# Altium schematic sheet CH341A.SchDoc
size A4
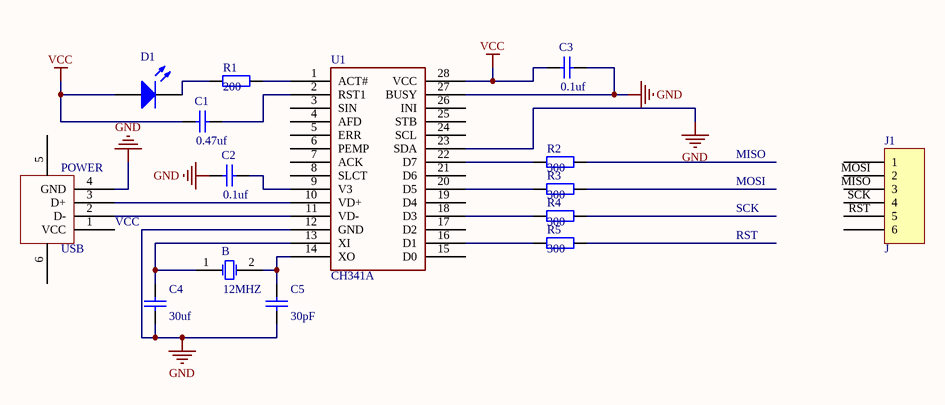
[diagram p0: CH341A.SchDoc]

## Parts
B  12MHZ  [R38]
C1  value 0.47uf  [RAD-0.3]  (hidden comment: Cap)
C2  value 0.1uf  [RAD-0.3]  (hidden comment: Cap)
C3  value 0.1uf  [RAD-0.3]  (hidden comment: Cap)
C4  value 30uf  [RAD-0.3]  (hidden comment: Cap)
C5  value 30pF  [RAD-0.3]  (hidden comment: Cap)
D1  LED0  [LED-0]  (value not drawn)
J1  J
R1  value 200  [AXIAL-0.4]  (hidden comment: Res2)
R2  value 300  [AXIAL-0.4]  (hidden comment: Res2)
R3  value 300  [AXIAL-0.4]  (hidden comment: Res2)
R4  value 300  [AXIAL-0.4]  (hidden comment: Res2)
R5  value 300  [AXIAL-0.4]  (hidden comment: Res2)
U1  CH341A
USB  POWER

## Nets
GND: C2.1 C3.2 C4.1 C5.1 U1.12(GND) U1.23(SDA) U1.27(BUSY) USB.4(GND)
VCC: C1.1 C3.1 D1.1(A) U1.28(VCC)
NetB_1: B.1(OSC1) C4.2 U1.13(XI)
NetB_2: B.2(OSC2) C5.2 U1.14(XO)
NetC1_2: C1.2 U1.2(RST1)
NetC2_2: C2.2 U1.9(V3)
NetD1_2: D1.2(K) R1.1
NetR1_2: R1.2 U1.1(ACT#)
NetR2_1: R2.1 U1.22(D7)
NetR3_1: R3.1 U1.20(D5)
NetR4_1: R4.1 U1.18(D3)
NetR5_1: R5.1 U1.16(D1)
NetU1_10: U1.10(VD+) USB.3(D+)
NetU1_11: U1.11(VD-) USB.2(D-)

Not connected (* = marked no-connect by the designer): J1 ?1(1) ?2(6) MISO(3) MOSI(2) RST(5) SCK(4); R2 2; R3 2; R4 2; R5 2; U1 3(SIN) 4(AFD) 5(ERR) 6(PEMP) 7(ACK) 8(SLCT) 15(D0) 17(D2) 19(D4) 21(D6) 24(SCL) 25(STB) 26(INI); USB 1(VCC) 5 6

## Notes on the sheet
- MISO
- MOSI
- SCK
- RST

## Library data of the parts
B = XTAL: Crystal Oscillator; Published: 8-Jun-2000; LatestRevisionDate: 17-Jul-2002; LatestRevisionNote: Re-released for DXP Platform.; PackageReference: R38; Publisher: Altium Limited; PackageDescription: Crystal, Thru-Hole; 2 Leads; Body 3.1 x 8.2 mm (Dia.xH)
C1-C5 = Cap: Capacitor; Published: 8-Jun-2000; LatestRevisionDate: 17-Jul-2002; LatestRevisionNote: Re-released for DXP Platform.; PackageReference: RAD-0.3; Publisher: Altium Limited; PackageDescription: Radial Cap, Thru-Hole; 2 Leads; 0.3 in Pin Spacing
D1 = LED0: Typical INFRARED GaAs LED; Published: 8-Jun-2000; LatestRevisionDate: 08-Jul-2005; LatestRevisionNote: Mech Layer 1 removed.; PackageReference: LED-0; Publisher: Altium Limited; PackageDescription: LED; 2 Leads
J1 = J1
R1-R5 = Res2: Resistor; Published: 8-Jun-2000; LatestRevisionDate: 17-Jul-2002; LatestRevisionNote: Re-released for DXP Platform.; PackageReference: AXIAL-0.4; Publisher: Altium Limited; PackageDescription: Axial Device, Thru-Hole; 2 Leads; 0.4 in Pin Spacing
U1 = U1